# Altium project sai.PrjPcb
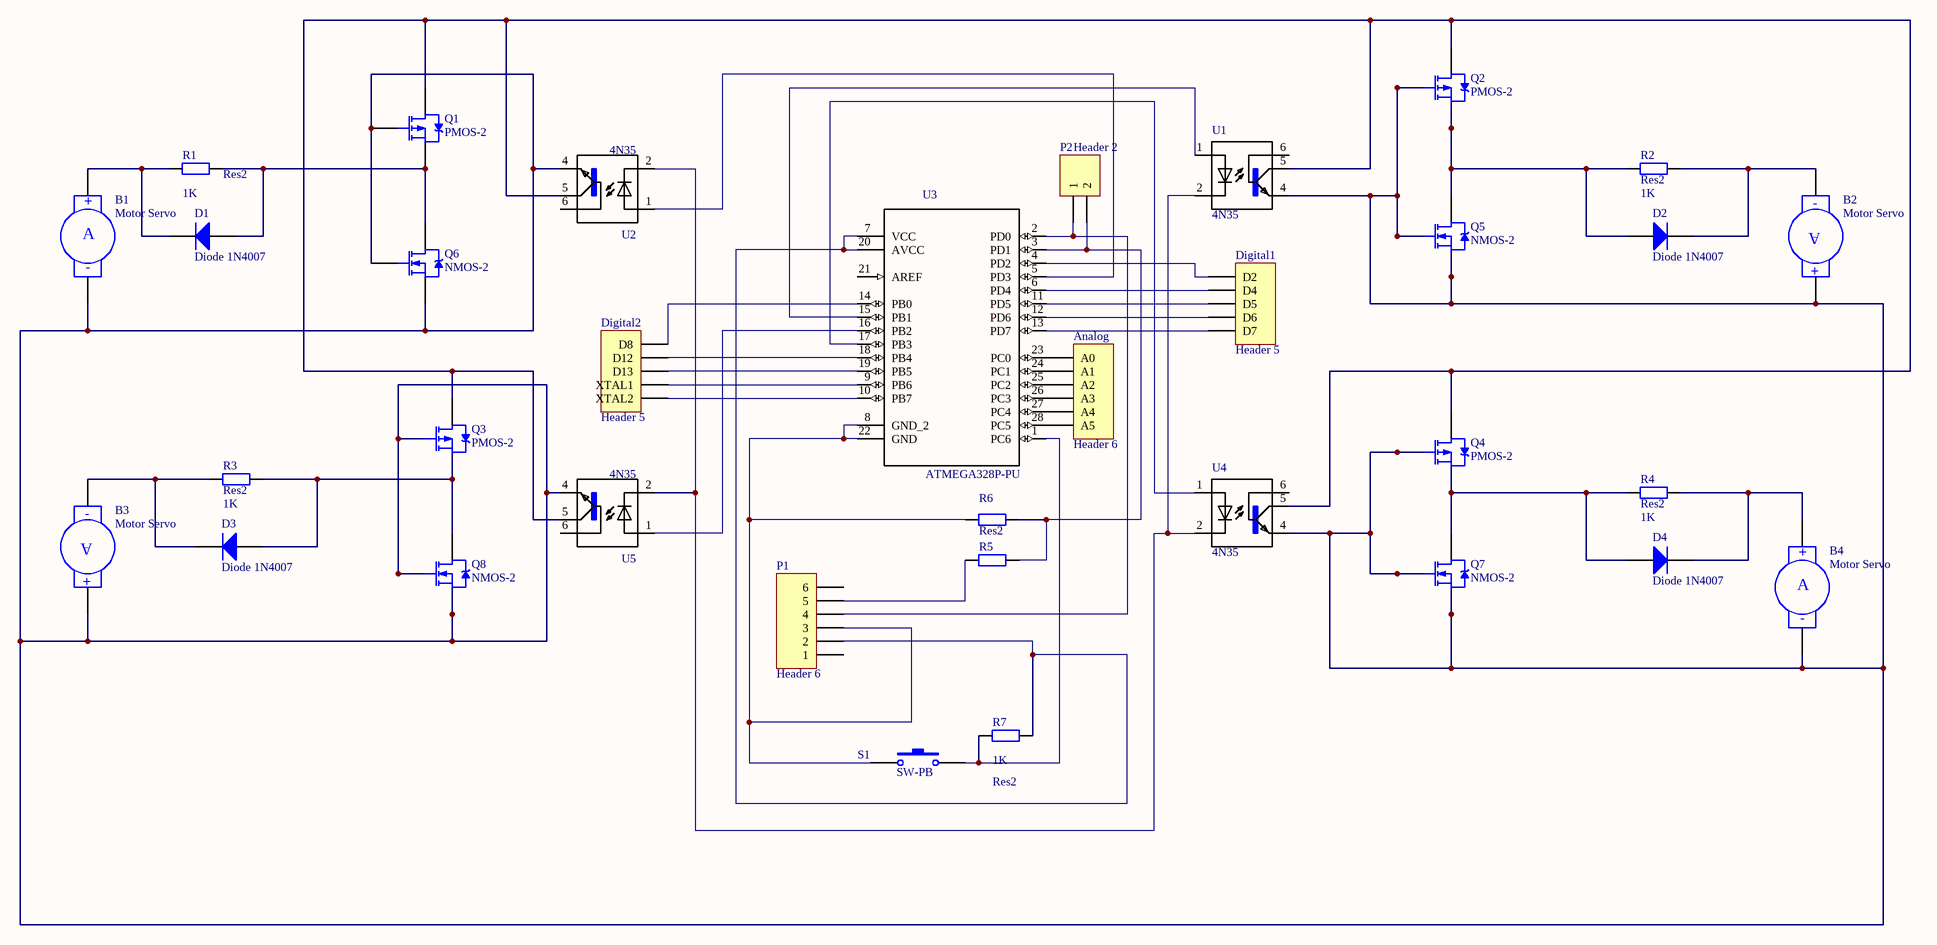
[diagram p0: sai_arduinoPinMap.SchDoc]
1 sheet, 34 parts. Net scope: global (net labels, ports and power ports of the same name join across sheets).
Board file: sai_arduinoPinMap.PcbDoc

## Sheet sai_arduinoPinMap.SchDoc
size A0

### Parts
Analog  Header 6  [HDR1X6]
B1  Motor Servo  [RAD-0.4]
B2  Motor Servo  [RAD-0.4]
B3  Motor Servo  [RAD-0.4]
B4  Motor Servo  [RAD-0.4]
D1  Diode 1N4007  [DO-41]
D2  Diode 1N4007  [DO-41]
D3  Diode 1N4007  [DO-41]
D4  Diode 1N4007  [DO-41]
Digital1  Header 5  [HDR1X5]
Digital2  Header 5  [HDR1X5]
P1  Header 6  [HDR1X6]
P2  Header 2  [HDR1X2]
Q1  PMOS-2  [TO-220AB]
Q2  PMOS-2  [TO-220AB]
Q3  PMOS-2  [TO-220AB]
Q4  PMOS-2  [TO-220AB]
Q5  NMOS-2  [TO-220AB]
Q6  NMOS-2  [TO-220AB]
Q7  NMOS-2  [TO-220AB]
Q8  NMOS-2  [TO-220AB]
R1  Res2  value 1K  [AXIAL-0.4]
R2  Res2  value 1K  [AXIAL-0.4]
R3  Res2  value 1K  [AXIAL-0.4]
R4  Res2  value 1K  [AXIAL-0.4]
R5  Res2  [AXIAL-0.4]  (value not drawn)
R6  Res2  [AXIAL-0.4]
R7  Res2  value 1K  [AXIAL-0.4]
S1  SW-PB  [SPST-2]
U1  4N35  [*DIL06]
U2  4N35  [*DIL06]
U3  ATMEGA328P-PU  [*DIP254P762X457-28]
U4  4N35  [*DIL06]
U5  4N35  [*DIL06]

### Nets
NetAnalog_1: Analog.1(A0) U3.23(PC0)
NetAnalog_2: Analog.2(A1) U3.24(PC1)
NetAnalog_3: Analog.3(A2) U3.25(PC2)
NetAnalog_4: Analog.4(A3) U3.26(PC3)
NetAnalog_5: Analog.5(A4) U3.27(PC4)
NetAnalog_6: Analog.6(A5) U3.28(PC5)
NetB1_1: B1.1(+) D1.2(K) R1.1
NetB1_2: B1.2(-) B2.1(+) B3.1(+) B4.2(-) Q1.1(G) Q2.1(G) Q3.1(G) Q4.1(G) Q5.1(G) Q5.3(S) Q6.1(G) Q6.3(S) Q7.1(G) Q7.3(S) Q8.1(G) Q8.3(S) U1.4(EMI) U2.4(EMI) U4.4(EMI) U5.4(EMI)
NetB2_2: B2.2(-) D2.2(K) R2.2
NetB3_2: B3.2(-) D3.2(K) R3.1
NetB4_1: B4.1(+) D4.2(K) R4.2
NetD1_1: D1.1(A) Q1.3(S) Q6.2(D) R1.2
NetD2_1: D2.1(A) Q2.3(S) Q5.2(D) R2.1
NetD3_1: D3.1(A) Q3.3(S) Q8.2(D) R3.2
NetD4_1: D4.1(A) Q4.3(S) Q7.2(D) R4.1
NetDigital1_1: Digital1.1(D2) U3.4(PD2)
NetDigital1_2: Digital1.2(D4) U3.6(PD4)
NetDigital1_3: Digital1.3(D5) U3.11(PD5)
NetDigital1_4: Digital1.4(D6) U3.12(PD6)
NetDigital1_5: Digital1.5(D7) U3.13(PD7)
NetDigital2_1: Digital2.1(D8) U3.14(PB0)
NetDigital2_2: Digital2.2(D12) U3.18(PB4)
NetDigital2_3: Digital2.3(D13) U3.19(PB5)
NetDigital2_4: Digital2.4(XTAL1) U3.9(PB6)
NetDigital2_5: Digital2.5(XTAL2) U3.10(PB7)
NetP1_2: P1.2 R7.2 U3.7(VCC) U3.20(AVCC)
NetP1_3: P1.3 R6.1 S1.1 U3.8(GND_2) U3.22(GND)
NetP1_4: P1.4 P2.1 U3.2(PD0)
NetP1_5: P1.5 R5.2
NetP2_2: P2.2 R5.1 R6.2 U3.3(PD1)
NetQ1_2: Q1.2(D) Q2.2(D) Q3.2(D) Q4.2(D) U1.5(COL) U2.5(COL) U4.5(COL) U5.5(COL)
NetR7_1: R7.1 S1.2 U3.1(PC6)
NetU1_1: U1.1(A) U3.15(PB1)
NetU1_2: U1.2(C) U2.2(C) U4.2(C) U5.2(C)
NetU2_1: U2.1(A) U3.5(PD3)
NetU3_16: U3.16(PB2) U5.1(A)
NetU3_17: U3.17(PB3) U4.1(A)

Not connected (* = marked no-connect by the designer): P1 1 6; U1 6(BAS); U2 6(BAS); U3 21(AREF); U4 6(BAS); U5 6(BAS)

### Notes on the sheet
- (in symbol Motor Servo) A

### Library data of the parts
Analog P1 = Header 6: Header, 6-Pin; LatestRevisionDate: 17-Jul-2002; LatestRevisionNote: Re-released for DXP Platform.; Publisher: Altium Limited
B1-B4 = Motor Servo: Servo Motor; Published: 24-Mar-1999; LatestRevisionDate: 17-Jul-2002; LatestRevisionNote: Re-released for DXP Platform.; PackageReference: RAD-0.4; Publisher: Altium Limited; PackageDescription: Radial Cap, Thru-Hole; 2 Leads; 0.4 in Pin Spacing
D1-D4 = Diode 1N4007: 1 Amp General Purpose Rectifier; Published: 8-Jun-2000; LatestRevisionDate: 17-Jul-2002; LatestRevisionNote: Re-released for DXP Platform.; DatasheetVersion: 1998; PackageVersion: Aug-1999; PackageReference: DO-41; Publisher: Altium Limited; PackageDescription: Diode, Axial; Body 5.2 x 2.7 mm (LxDia. max), Lead Dia. 0.86 mm (max); Code_JEDEC: DO-204-AL; ComponentLink1Description: Manufacturer Link; ComponentLink1URL: http://www.fairchildsemi.com/; ComponentLink2Description: Datasheet; ComponentLink2URL: http://www.fairchildsemi.com/ds/1N%2F1N4001.pdf
Digital1 Digital2 = Header 5: Header, 5-Pin; LatestRevisionDate: 17-Jul-2002; LatestRevisionNote: Re-released for DXP Platform.; Publisher: Altium Limited
P2 = Header 2: Header, 2-Pin; LatestRevisionDate: 17-Jul-2002; LatestRevisionNote: Re-released for DXP Platform.; Publisher: Altium Limited
Q1-Q4 = PMOS-2: P-Channel Power MOSFET; Note: Pin 4 not drawn and electrically connected to Pin 2.; Published: 8-Jun-2000; LatestRevisionDate: 17-Jul-2002; LatestRevisionNote: Re-released for DXP Platform.; DatasheetVersion: PD-9.390D; PackageVersion: Feb-1997; PackageReference: TO-220AB; Publisher: Altium Limited; PackageDescription: TO, Thru-Hole, Vertical, Heatsink Mounted; 3 In-Line Leads; Pitch 2.54 mm; ComponentLink1Description: Manufacturer Link; ComponentLink1URL: http://www.irf.com/
Q5-Q8 = NMOS-2: N-Channel Power MOSFET; Note: Pin 2 is electrically connected to pin 4.; Published: 8-Jun-2000; LatestRevisionDate: 17-Jul-2002; LatestRevisionNote: Re-released for DXP Platform.; DatasheetVersion: PD-9.814; PackageVersion: Feb-1997; PackageReference: TO-220AB; Publisher: Altium Limited; PackageDescription: TO, Thru-Hole, Vertical, Heatsink Mounted; 3 In-Line Leads; Pitch 2.54 mm; ComponentLink1Description: Manufacturer Link; ComponentLink1URL: http://www.irf.com/
R1-R4 R6 R7 = Res2: Resistor; Published: 8-Jun-2000; LatestRevisionDate: 17-Jul-2002; LatestRevisionNote: Re-released for DXP Platform.; PackageReference: AXIAL-0.4; Publisher: Altium Limited; PackageDescription: Axial Device, Thru-Hole; 2 Leads; 0.4 in Pin Spacing
R5 = Res2: Resistor; Value: 1K; Published: 8-Jun-2000; LatestRevisionDate: 17-Jul-2002; LatestRevisionNote: Re-released for DXP Platform.; PackageReference: AXIAL-0.4; Publisher: Altium Limited; PackageDescription: Axial Device, Thru-Hole; 2 Leads; 0.4 in Pin Spacing
S1 = SW-PB: Switch; Published: 24-Mar-1999; LatestRevisionDate: 17-Jul-2002; LatestRevisionNote: Re-released for DXP Platform.; PackageReference: SPST-2; Publisher: Altium Limited; PackageDescription: Switch; 2 Leads
U1 U2 U4 U5 = 4N35: Optoisolator; Analog; 6-Pin DIP; Transistor; 6 PIN SINGLE; 100% CTR;; MF: Vishay Semiconductor; SnapEDA_Link: https://www.snapeda.com/parts/4N35/Vishay%20Semiconductor%20Opto%20Division/view-part/?ref=snap; Price: None; Availability: Unavailable; Package: DIP-6 Infineon; MP: 4N35; Value: *
U3 = ATMEGA328P-PU: Embedded microcontroller ATMEGA328P-PU PDIP 28 Microchip Technology 8-Bit 20 MHz I/O number 23; MP: ATMEGA328P-PU; SnapEDA_Link: https://www.snapeda.com/parts/ATMEGA328P-PU/Microchip/view-part/?ref=snap; Price: None; Availability: Unavailable; Package: PDIP-28 Microchip; MF: Microchip; Value: *